# Altium schematic sheet 2008_SablierElectronique_Commande_Matrice.SchDoc
size A3; Author: Carlos Reyes Peña; Organization: ETML-ES; Address1: Avenue Recordon 1; Address2: 1004 Lausanne; Address3: Switzerland; Revision: 1; SheetNumber: 2; SheetTotal: 4; Version: A
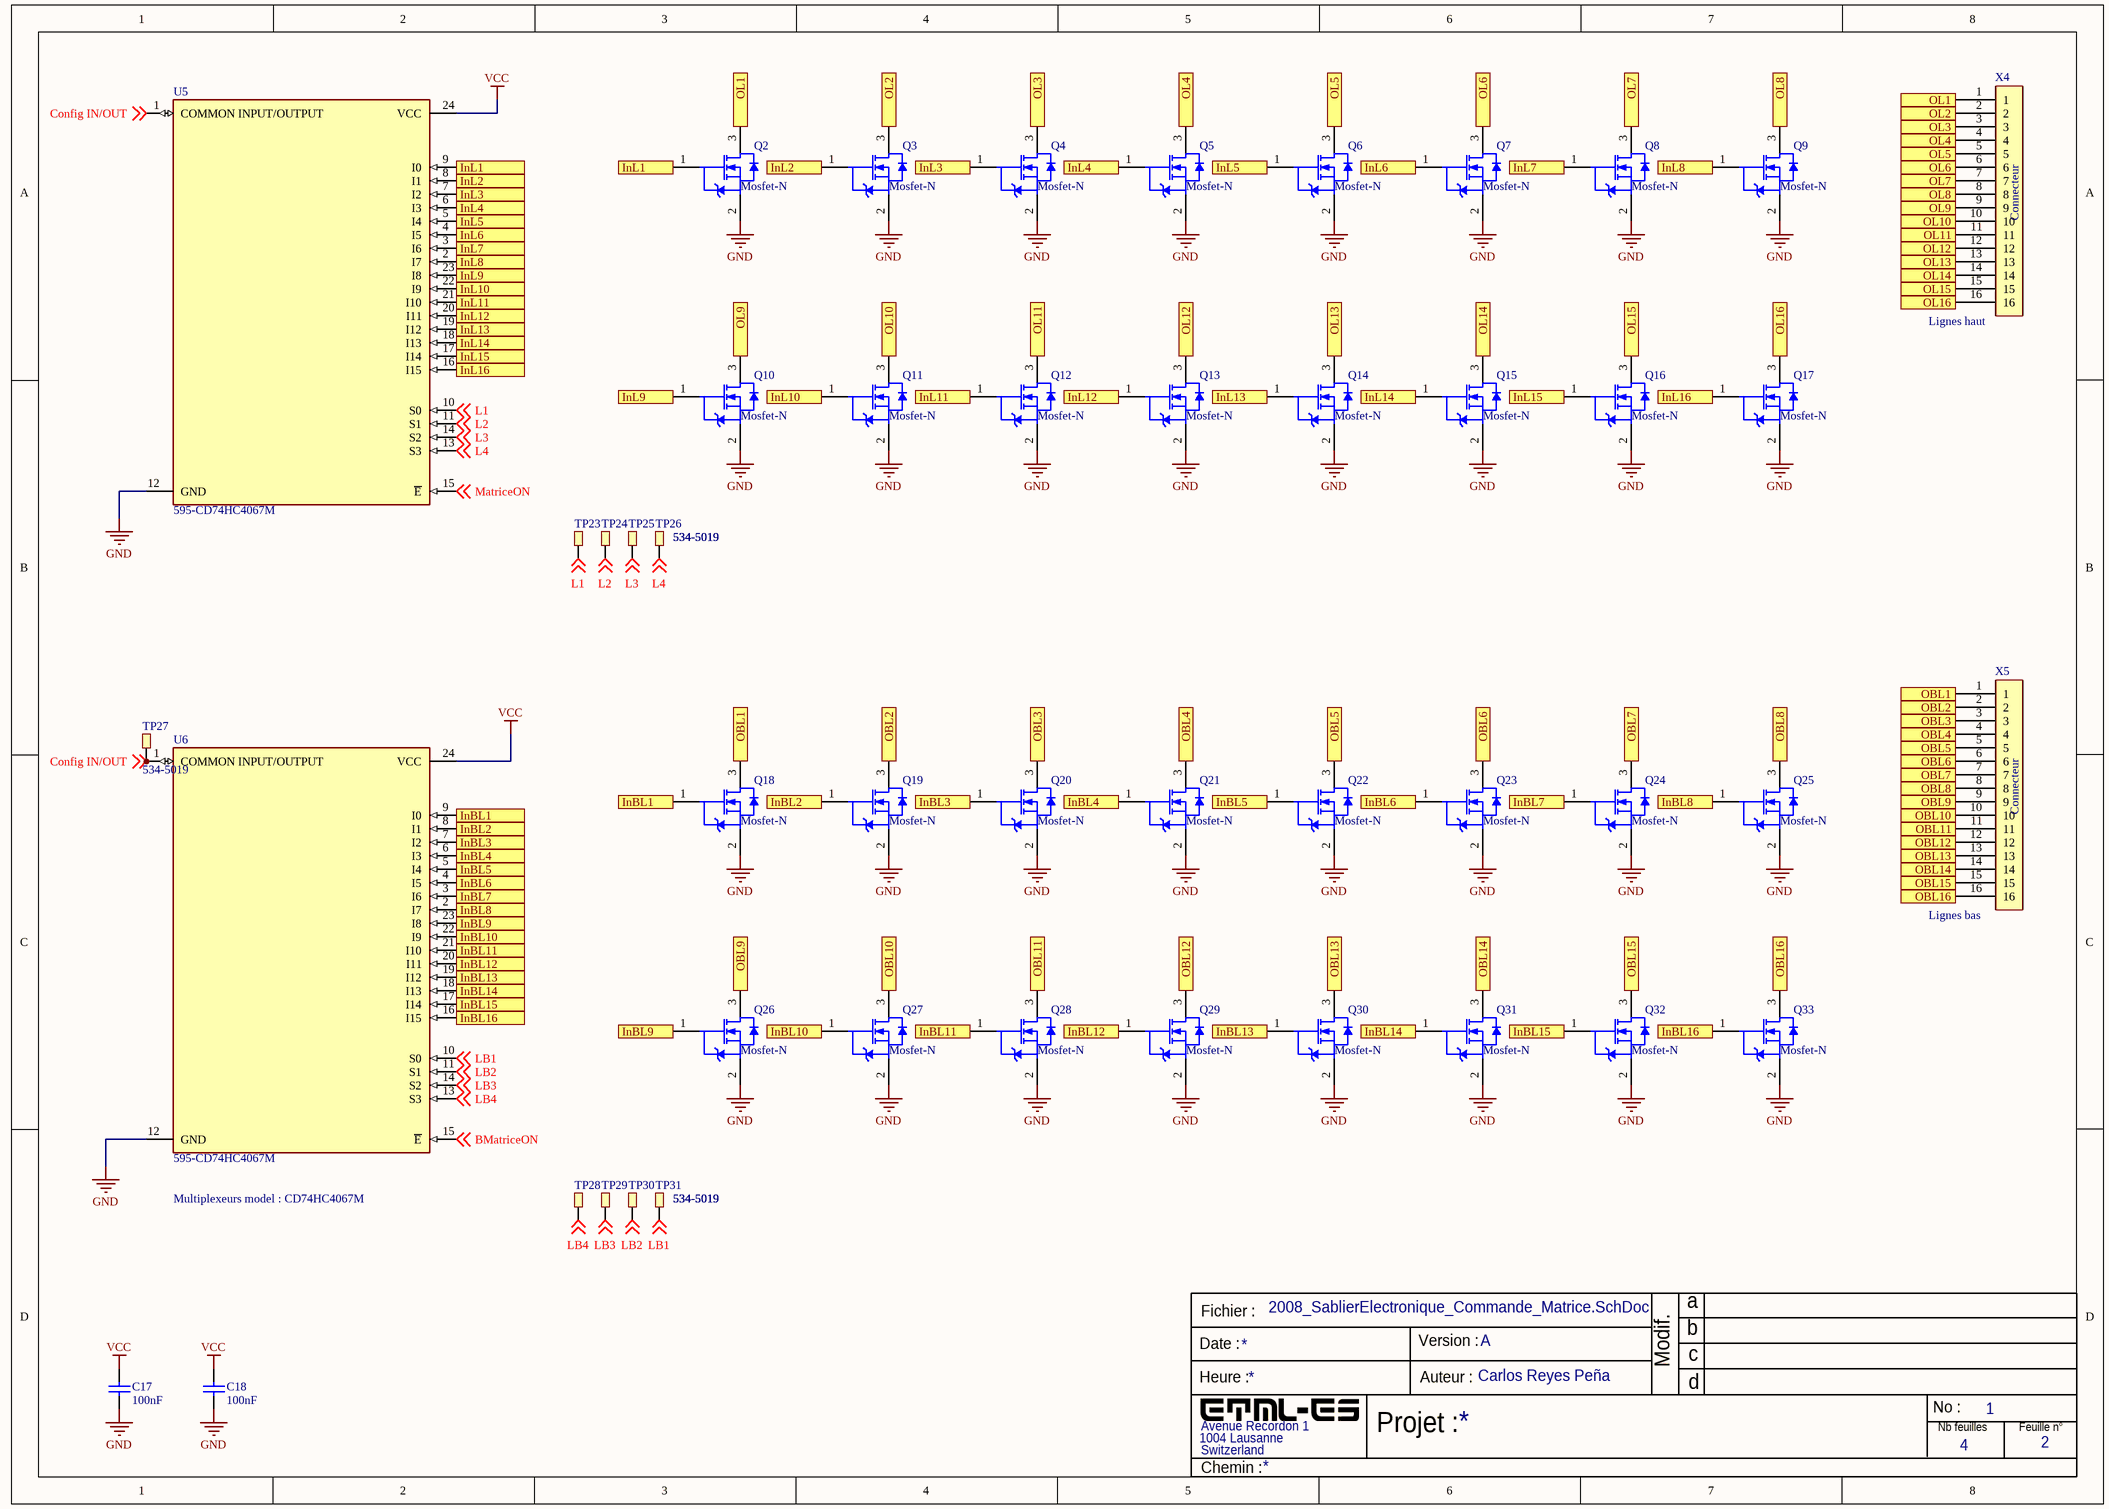
[diagram p0: 2008_SablierElectronique_Commande_Matrice.SchDoc]

## Parts
C17  100nF  [RESC0805(2012)_L]
C18  100nF  [RESC0805(2012)_L]
Q2  Mosfet-N  [FAIR-SOT23-3_V]
Q3  Mosfet-N  [FAIR-SOT23-3_V]
Q4  Mosfet-N  [FAIR-SOT23-3_V]
Q5  Mosfet-N  [FAIR-SOT23-3_V]
Q6  Mosfet-N  [FAIR-SOT23-3_V]
Q7  Mosfet-N  [FAIR-SOT23-3_V]
Q8  Mosfet-N  [FAIR-SOT23-3_V]
Q9  Mosfet-N  [FAIR-SOT23-3_V]
Q10  Mosfet-N  [FAIR-SOT23-3_V]
Q11  Mosfet-N  [FAIR-SOT23-3_V]
Q12  Mosfet-N  [FAIR-SOT23-3_V]
Q13  Mosfet-N  [FAIR-SOT23-3_V]
Q14  Mosfet-N  [FAIR-SOT23-3_V]
Q15  Mosfet-N  [FAIR-SOT23-3_V]
Q16  Mosfet-N  [FAIR-SOT23-3_V]
Q17  Mosfet-N  [FAIR-SOT23-3_V]
Q18  Mosfet-N  [FAIR-SOT23-3_V]
Q19  Mosfet-N  [FAIR-SOT23-3_V]
Q20  Mosfet-N  [FAIR-SOT23-3_V]
Q21  Mosfet-N  [FAIR-SOT23-3_V]
Q22  Mosfet-N  [FAIR-SOT23-3_V]
Q23  Mosfet-N  [FAIR-SOT23-3_V]
Q24  Mosfet-N  [FAIR-SOT23-3_V]
Q25  Mosfet-N  [FAIR-SOT23-3_V]
Q26  Mosfet-N  [FAIR-SOT23-3_V]
Q27  Mosfet-N  [FAIR-SOT23-3_V]
Q28  Mosfet-N  [FAIR-SOT23-3_V]
Q29  Mosfet-N  [FAIR-SOT23-3_V]
Q30  Mosfet-N  [FAIR-SOT23-3_V]
Q31  Mosfet-N  [FAIR-SOT23-3_V]
Q32  Mosfet-N  [FAIR-SOT23-3_V]
Q33  Mosfet-N  [FAIR-SOT23-3_V]
TP23  Supplier Part Number 1: 534-5019  [TESTPOINT_SMD]  (hidden comment: 5019)
TP24  Supplier Part Number 1: 534-5019  [TESTPOINT_SMD]  (hidden comment: 5019)
TP25  Supplier Part Number 1: 534-5019  [TESTPOINT_SMD]  (hidden comment: 5019)
TP26  Supplier Part Number 1: 534-5019  [TESTPOINT_SMD]  (hidden comment: 5019)
TP27  Supplier Part Number 1: 534-5019  [TESTPOINT_SMD]  (hidden comment: 5019)
TP28  Supplier Part Number 1: 534-5019  [TESTPOINT_SMD]  (hidden comment: 5019)
TP29  Supplier Part Number 1: 534-5019  [TESTPOINT_SMD]  (hidden comment: 5019)
TP30  Supplier Part Number 1: 534-5019  [TESTPOINT_SMD]  (hidden comment: 5019)
TP31  Supplier Part Number 1: 534-5019  [TESTPOINT_SMD]  (hidden comment: 5019)
U5  Supplier Part Number 1: 595-CD74HC4067M  [SOIC24]  (hidden comment: CD74HCT4067)
U6  Supplier Part Number 1: 595-CD74HC4067M  [SOIC24]  (hidden comment: CD74HCT4067)
X4  Lignes haut  [CON8x8(edited)]
X5  Lignes bas  [CON8x8(edited)]

## Ports
InBL1 (in), InBL1 (out), InBL2 (in), InBL2 (out), InBL3 (in), InBL3 (out), InBL4 (in), InBL4 (out), InBL5 (in), InBL5 (out), InBL6 (in), InBL6 (out), InBL7 (in), InBL7 (out), InBL8 (in), InBL8 (out), InBL9 (in), InBL9 (out), InBL10 (in), InBL10 (out), InBL11 (in), InBL11 (out), InBL12 (in), InBL12 (out), InBL13 (in), InBL13 (out), InBL14 (in), InBL14 (out), InBL15 (in), InBL15 (out), InBL16 (in), InBL16 (out), InL1 (in), InL1 (out), InL2 (in), InL2 (out), InL3 (in), InL3 (out), InL4 (in), InL4 (out), InL5 (in), InL5 (out), InL6 (in), InL6 (out), InL7 (in), InL7 (out), InL8 (in), InL8 (out), InL9 (in), InL9 (out), InL10 (in), InL10 (out), InL11 (in), InL11 (out), InL12 (in), InL12 (out), InL13 (in), InL13 (out), InL14 (in), InL14 (out), InL15 (in), InL15 (out), InL16 (in), InL16 (out), OBL1 (in), OBL1 (out), OBL2 (in), OBL2 (out), OBL3 (in), OBL3 (out), OBL4 (in), OBL4 (out), OBL5 (in), OBL5 (out), OBL6 (in), OBL6 (out), OBL7 (in), OBL7 (out), OBL8 (in), OBL8 (out), OBL9 (in), OBL9 (out), OBL10 (in), OBL10 (out), OBL11 (in), OBL11 (out), OBL12 (in), OBL12 (out), OBL13 (in), OBL13 (out), OBL14 (in), OBL14 (out), OBL15 (in), OBL15 (out), OBL16 (in), OBL16 (out), OL1 (in), OL1 (out), OL2 (in), OL2 (out), OL3 (in), OL3 (out), OL4 (in), OL4 (out), OL5 (in), OL5 (out), OL6 (in), OL6 (out), OL7 (in), OL7 (out), OL8 (in), OL8 (out), OL9 (in), OL9 (out), OL10 (in), OL10 (out), OL11 (in), OL11 (out), OL12 (in), OL12 (out), OL13 (in), OL13 (out), OL14 (in), OL14 (out), OL15 (in), OL15 (out), OL16 (in), OL16 (out)

## Nets
GND: C17.1 C18.1 Q2.2(S) Q3.2(S) Q4.2(S) Q5.2(S) Q6.2(S) Q7.2(S) Q8.2(S) Q9.2(S) Q10.2(S) Q11.2(S) Q12.2(S) Q13.2(S) Q14.2(S) Q15.2(S) Q16.2(S) Q17.2(S) Q18.2(S) Q19.2(S) Q20.2(S) Q21.2(S) Q22.2(S) Q23.2(S) Q24.2(S) Q25.2(S) Q26.2(S) Q27.2(S) Q28.2(S) Q29.2(S) Q30.2(S) Q31.2(S) Q32.2(S) Q33.2(S) U5.12(GND) U6.12(GND)
VCC: C17.2 C18.2 U5.24(VCC) U6.24(VCC)
BMatriceON: U6.15(~{E}) ; off-sheet BMatriceON
Config IN/OUT: TP27.1 U5.1(COMMON_INPUT/OUTPUT) U6.1(COMMON_INPUT/OUTPUT) ; off-sheet Config IN/OUT
InBL1: Q18.1(G) U6.9(I0) ; port InBL1
InBL2: Q19.1(G) U6.8(I1) ; port InBL2
InBL3: Q20.1(G) U6.7(I2) ; port InBL3
InBL4: Q21.1(G) U6.6(I3) ; port InBL4
InBL5: Q22.1(G) U6.5(I4) ; port InBL5
InBL6: Q23.1(G) U6.4(I5) ; port InBL6
InBL7: Q24.1(G) U6.3(I6) ; port InBL7
InBL8: Q25.1(G) U6.2(I7) ; port InBL8
InBL9: Q26.1(G) U6.23(I8) ; port InBL9
InBL10: Q27.1(G) U6.22(I9) ; port InBL10
InBL11: Q28.1(G) U6.21(I10) ; port InBL11
InBL12: Q29.1(G) U6.20(I11) ; port InBL12
InBL13: Q30.1(G) U6.19(I12) ; port InBL13
InBL14: Q31.1(G) U6.18(I13) ; port InBL14
InBL15: Q32.1(G) U6.17(I14) ; port InBL15
InBL16: Q33.1(G) U6.16(I15) ; port InBL16
InL1: Q2.1(G) U5.9(I0) ; port InL1
InL2: Q3.1(G) U5.8(I1) ; port InL2
InL3: Q4.1(G) U5.7(I2) ; port InL3
InL4: Q5.1(G) U5.6(I3) ; port InL4
InL5: Q6.1(G) U5.5(I4) ; port InL5
InL6: Q7.1(G) U5.4(I5) ; port InL6
InL7: Q8.1(G) U5.3(I6) ; port InL7
InL8: Q9.1(G) U5.2(I7) ; port InL8
InL9: Q10.1(G) U5.23(I8) ; port InL9
InL10: Q11.1(G) U5.22(I9) ; port InL10
InL11: Q12.1(G) U5.21(I10) ; port InL11
InL12: Q13.1(G) U5.20(I11) ; port InL12
InL13: Q14.1(G) U5.19(I12) ; port InL13
InL14: Q15.1(G) U5.18(I13) ; port InL14
InL15: Q16.1(G) U5.17(I14) ; port InL15
InL16: Q17.1(G) U5.16(I15) ; port InL16
L1: TP23.1 U5.10(S0) ; off-sheet L1
L2: TP24.1 U5.11(S1) ; off-sheet L2
L3: TP25.1 U5.14(S2) ; off-sheet L3
L4: TP26.1 U5.13(S3) ; off-sheet L4
LB1: TP31.1 U6.10(S0) ; off-sheet LB1
LB2: TP30.1 U6.11(S1) ; off-sheet LB2
LB3: TP29.1 U6.14(S2) ; off-sheet LB3
LB4: TP28.1 U6.13(S3) ; off-sheet LB4
MatriceON: U5.15(~{E}) ; off-sheet MatriceON
OBL1: Q18.3(D) X5.1 ; port OBL1
OBL2: Q19.3(D) X5.2 ; port OBL2
OBL3: Q20.3(D) X5.3 ; port OBL3
OBL4: Q21.3(D) X5.4 ; port OBL4
OBL5: Q22.3(D) X5.5 ; port OBL5
OBL6: Q23.3(D) X5.6 ; port OBL6
OBL7: Q24.3(D) X5.7 ; port OBL7
OBL8: Q25.3(D) X5.8 ; port OBL8
OBL9: Q26.3(D) X5.9 ; port OBL9
OBL10: Q27.3(D) X5.10 ; port OBL10
OBL11: Q28.3(D) X5.11 ; port OBL11
OBL12: Q29.3(D) X5.12 ; port OBL12
OBL13: Q30.3(D) X5.13 ; port OBL13
OBL14: Q31.3(D) X5.14 ; port OBL14
OBL15: Q32.3(D) X5.15 ; port OBL15
OBL16: Q33.3(D) X5.16 ; port OBL16
OL1: Q2.3(D) X4.1 ; port OL1
OL2: Q3.3(D) X4.2 ; port OL2
OL3: Q4.3(D) X4.3 ; port OL3
OL4: Q5.3(D) X4.4 ; port OL4
OL5: Q6.3(D) X4.5 ; port OL5
OL6: Q7.3(D) X4.6 ; port OL6
OL7: Q8.3(D) X4.7 ; port OL7
OL8: Q9.3(D) X4.8 ; port OL8
OL9: Q10.3(D) X4.9 ; port OL9
OL10: Q11.3(D) X4.10 ; port OL10
OL11: Q12.3(D) X4.11 ; port OL11
OL12: Q13.3(D) X4.12 ; port OL12
OL13: Q14.3(D) X4.13 ; port OL13
OL14: Q15.3(D) X4.14 ; port OL14
OL15: Q16.3(D) X4.15 ; port OL15
OL16: Q17.3(D) X4.16 ; port OL16

## Notes on the sheet
- Multiplexeurs model : CD74HC4067M
- Fichier :
- a
- Date :
- Heure :
- Version :
- Auteur :
- Modif.
- b
- c
- d
- Projet :
- No :
- Nb feuilles
- Feuille n°
- Chemin :
- (in symbol Mâle DIN 8 x 8) Connecteur

## Library data of the parts
C17 C18 = CAP1206
Q2-Q33 = NEMOS-GSD-3_D
TP23-TP31 = TESTPOINT: Test point smd; Supplier 1: Mouser
X4 X5 = Mâle DIN 8 x 8
U5 U6 = CD74HCT4067: Supplier 1: Mouser